# EAGLE schematic NetworkArduino (EAGLE 7.4.0)
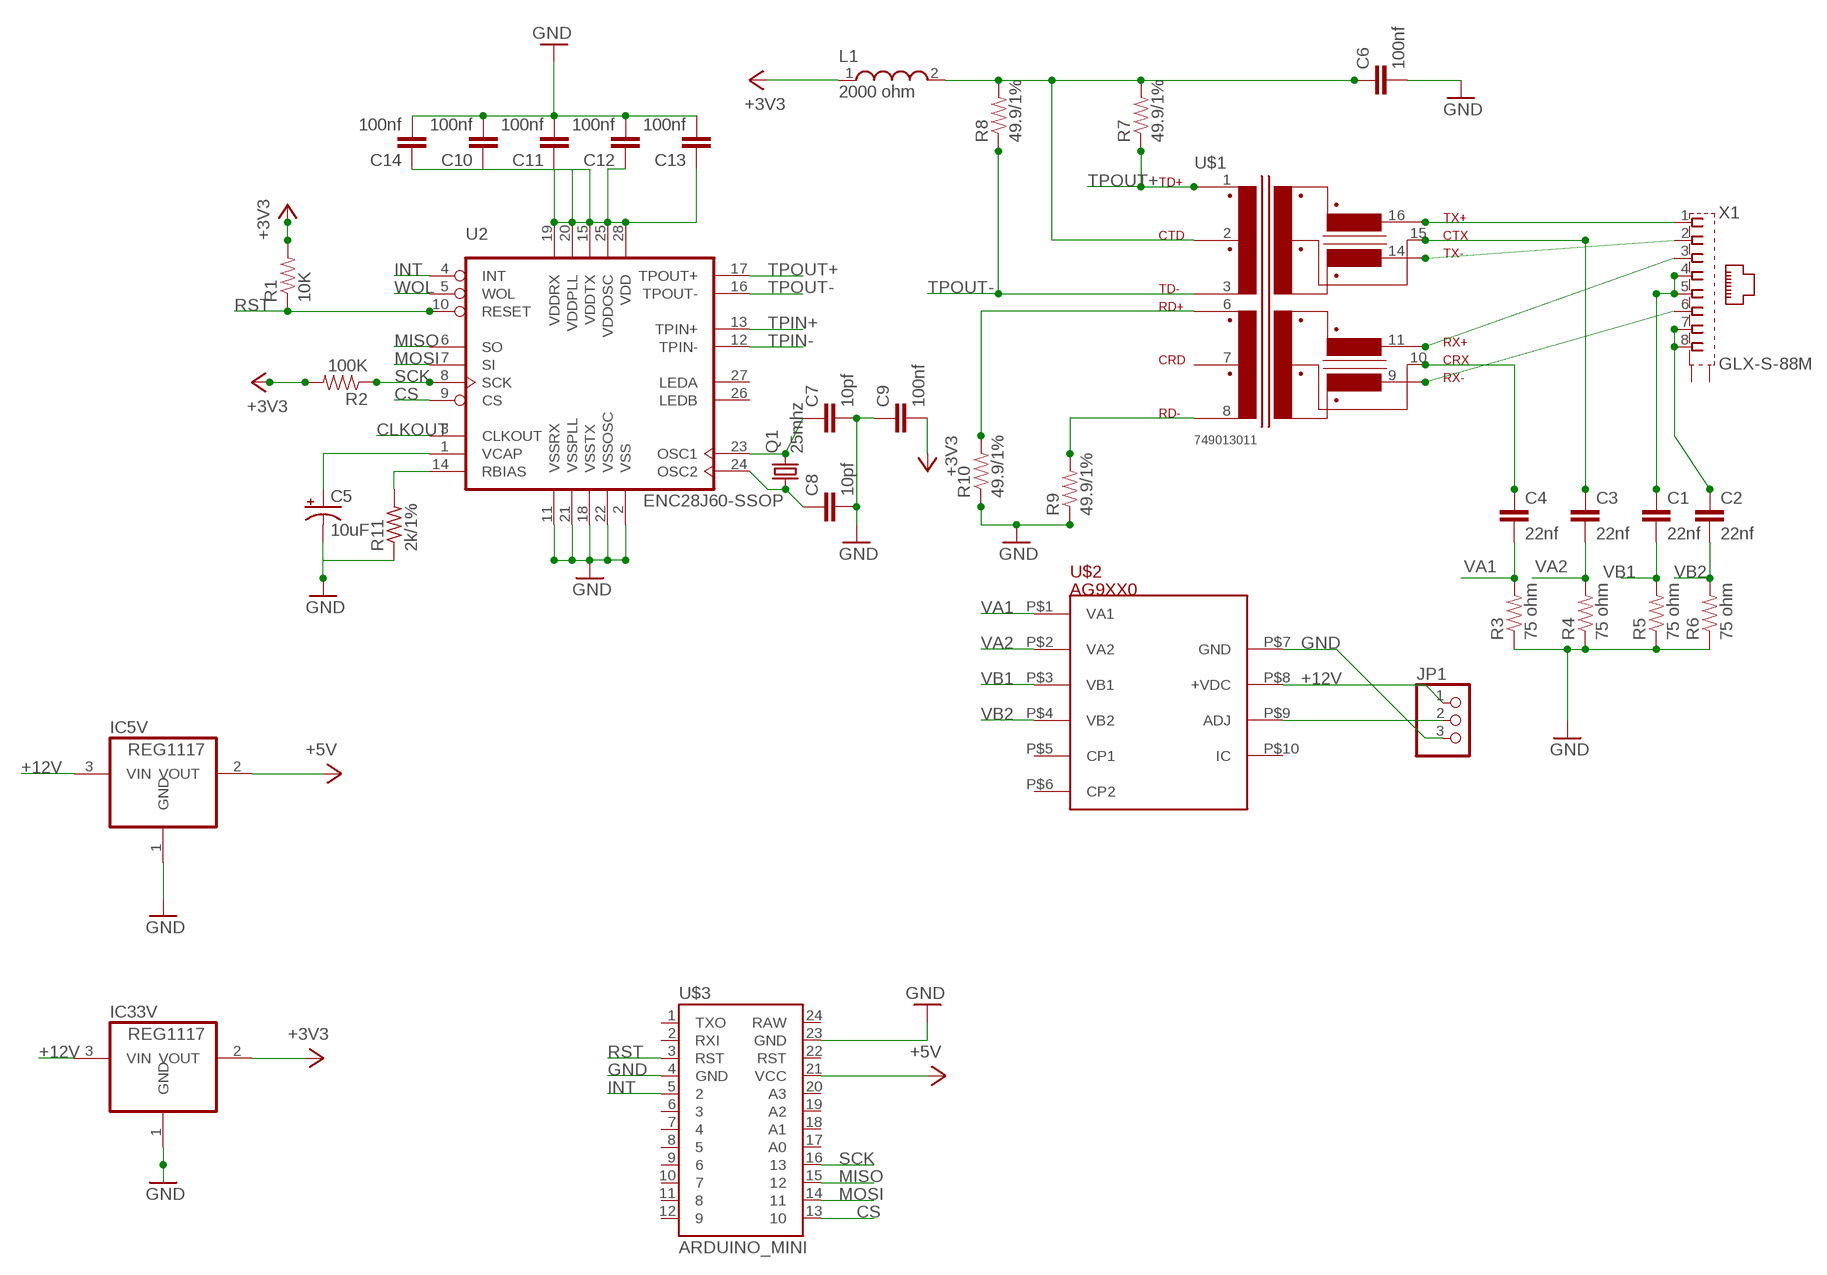
[diagram p0: schematic, sheet 1]

## Parts
C1  22nf  CAP0805  [0805]
C2  22nf  CAP0805  [0805]
C3  22nf  CAP0805  [0805]
C4  22nf  CAP0805  [0805]
C5  10uF  10UF-16V-10%(TANT)  [EIA3216]
C6  100nf  CAP0805  [0805]
C7  10pf  CAP0805  [0805]
C8  10pf  CAP0805  [0805]
C9  100nf  CAP0805  [0805]
C10  100nf  CAP0805  [0805]
C11  100nf  CAP0805  [0805]
C12  100nf  CAP0805  [0805]
C13  100nf  CAP0805  [0805]
C14  100nf  CAP0805  [0805]
IC5V  REG1117  [SOT223]
IC33V  REG1117  [SOT223]
JP1  PINHD-1X3  [1X03]
L1  2000 ohm  WE-CBA_0805(WB/HS)  [WE-CBA_0805(W=3)]
Q1  25mhz  CRYSTALHC49UP  [HC49UP]
R1  10K  RESISTOR0805-RES  [0805]
R2  100K  RESISTOR0805-RES  [0805]
R3  75 ohm  RESISTOR0805-RES  [0805]
R4  75 ohm  RESISTOR0805-RES  [0805]
R5  75 ohm  RESISTOR0805-RES  [0805]
R6  75 ohm  RESISTOR0805-RES  [0805]
R7  49.9/1%  RESISTOR0805-RES  [0805]
R8  49.9/1%  RESISTOR0805-RES  [0805]
R9  49.9/1%  RESISTOR0805-RES  [0805]
R10  49.9/1%  RESISTOR0805-RES  [0805]
R11  2k/1%  R-US_R0805  [R0805]
U2  ENC28J60-SSOP  [SSOP28]
U$1  749013011  [749013011]
U$2  AG9XX0  [AG9000]
U$3  ARDUINO_MINI  [ARDUINO_MINI]
X1  GLX-S-88M  [GLX-S-88M]

## Nets
+3V3: C9.2 IC33V.2(VOUT) L1.1 R1.2 R2.2
+5V: IC5V.2(VOUT) U$3.21(VCC)
+12V: IC5V.3(VIN) IC33V.3(VIN) JP1.1 U$2.P$8(+VDC)
CLKOUT: U2.3(CLKOUT)
CS: U2.9(CS) U$3.13
GND: C5.C(-) C6.2 C7.2 C8.2 C9.1 C10.2 C11.2 C12.2 C13.2 C14.2 IC5V.1(GND) IC33V.1(GND) JP1.3 R3.1 R4.1 R5.1 R6.1 R9.1 R10.1 R11.1 U2.2(VSS) U2.11(VSSRX) U2.18(VSSTX) U2.21(VSSPLL) U2.22(VSSOSC) U$2.P$7(GND) U$3.4(GND) U$3.23(GND)
INT: U2.4(INT) U$3.5
MISO: U2.6(SO) U$3.15
MOSI: U2.7(SI) U$3.14
N$1: U$1.16 X1.1
N$2: U$1.14 X1.2
N$3: U$1.11 X1.3
N$4: U$1.9 X1.6
N$5: C2.1 X1.7 X1.8
N$6: C1.1 X1.4 X1.5
N$7: C3.1 U$1.15
N$8: C4.1 U$1.10
N$9: C6.1 L1.2 R7.2 R8.2 U$1.2
N$10: C7.1 Q1.2 U2.23(OSC1)
N$11: JP1.2 U$2.P$9(ADJ)
N$13: C8.1 Q1.1 U2.24(OSC2)
N$14: C10.1 C11.1 C12.1 C13.1 C14.1 U2.15(VDDTX) U2.19(VDDRX) U2.20(VDDPLL) U2.25(VDDOSC) U2.28(VDD)
N$16: C5.A(+) U2.1(VCAP)
N$17: R11.2 U2.14(RBIAS)
RST: R1.1 U2.10(RESET) U$3.3(RST)
SCK: R2.1 U2.8(SCK) U$3.16
TPIN+: R10.2 U2.13(TPIN+) U$1.6
TPIN-: R9.2 U2.12(TPIN-) U$1.8
TPOUT+: R7.1 U2.17(TPOUT+) U$1.1
TPOUT-: R8.1 U2.16(TPOUT-) U$1.3
VA1: C4.2 R3.2 U$2.P$1(VA1)
VA2: C3.2 R4.2 U$2.P$2(VA2)
VB1: C1.2 R5.2 U$2.P$3(VB1)
VB2: C2.2 R6.2 U$2.P$4(VB2)
WOL: U2.5(WOL)
Unconnected: U2.26(LEDB) U2.27(LEDA) U$1.7 U$2.P$5(CP1) U$2.P$6(CP2) U$2.P$10(IC) U$3.1(TXO) U$3.2(RXI) U$3.6 U$3.7 U$3.8 U$3.9 U$3.10 U$3.11 U$3.12 U$3.17(A0) U$3.18(A1) U$3.19(A2) U$3.20(A3) U$3.22(RST) U$3.24(RAW) X1.S1 X1.S2

## Library data of the parts
C1-C4 C6-C14 = SparkFun-Capacitors:CAP: Capacitor Standard 0603 ceramic capacitor, and 0.1" leaded capacitor.
C5 = SparkFun-Capacitors:10UF-16V-10%(TANT): CAP-00811 1206/EIA-3216 Tantalum capacitor; PROD_ID: CAP-00811
IC5V IC33V = burr-brown:REG1117: 800mA and 1A Low Dropout (LDO) Positive Regulator 1.8V, 2.5V, 2.85V, 3.3V, 5V, and Adj; MPN: REG1117; OC_FARNELL: 1097566; OC_NEWARK: 14P6981
JP1 = Adafruit:PINHD-1X3: PIN HEADER
L1 = SignalCommunications:WE-CBA: WE-CBA SMD EMI Suppression Ferrite Bead Characteristics Reliable Ni-Sn electrodes High rated current up to 5A Recommended soldering: Reflow Operating temperature: -55°C to +125°C Applications * Perfect as data line filter and for uncoupling of distribution voltage *This special SMD chip bead ferrites can be put directly on the printed circuit board. They offer excellent anti-EMI properties and low DC-resistance. Placed very close next to the interference source even with smallest size 0402,maximal impedance at 1000 Ω can be reached. *High Speed: "High Speed " SMD ferrites WE-CBF have lower impedance in the lower frequency ranges thus they have only a low attenuation for fast signals. Application e.g. USB 2.0, IEEE 1394,LVDS *Wide Band: "Wide Band" SMD ferrites WE-CBF already show high impedance in low frequency range. Therefore they are wide band through the whole spectrum. Application e.g. control signats, RS232, RS422, DC/DC converter *High Current: "High Current " SMD ferrites WE-CBF are designed for high current (over 1 A). The rated current refers to 40K self-heating. High current SMD ferrites are available in all there types (High Speed, Wide Band and High Frequency). Application e.g. power supply, DC/DC converter *Advice: Pay attention for the use of SMD-Ferrites for high current>1A and ambient temperature over +85°C that the rated current has to be reduced when temperature is above +85°C (Derating). *At+100°C environment temperature the maximal rated current has to add up to only 60% of the data sheet value ,without an overload of the component. Variant abbreviation WB means WIDE BAND HS means HIGH SPEED HC means HIGH CURRENT <http://katalog.we-online.de/media/images/eisos/FeCBA_pf2.jpg> Details see: http://katalog.we-online.de/en/pbs/WE-CBA/ Created: 2015-02-02 2015 (C) Wurth Elektronik
Q1 = Adafruit:CRYSTAL: CRYSTAL; OC_FARNELL: unknown; OC_NEWARK: unknown
R1-R10 = SparkFun-Resistors:RESISTOR: Resistor Basic schematic elements and footprints for 0603, 1206, and PTH resistors.
R11 = Adafruit:R-US_: RESISTOR, American symbol
U2 = microchip-enc28j60:ENC28J60-*: Microchip 10Mbit Eth. contoller with SPI interface
U$1 = Wurth_Electronics_Midcom_Speedy_and_standard_magnetics:749013011: Package Style: 10/100, 1 Port, ETR, PoE Mounting: SMD Pins: 16 pins Header: 250-0512 Best pinouts for production vary per application. Please contact Wurth Electronics Midcom, Inc. for assistance with your custom design. Datasheet: 749013011 <http://katalog.we-online.de/kataloge/eisos/media/pdf/749013011.pdf> Website: Wurth Electronics Midcom <http://www.we-online.com/midcom> Contact us Wurth Electronics Midcom, Inc. 121 Airport Dr. Watertown, SD 57201 Phone: (605) 886-4385 Fax: (605) 886-4486 E-Mail: midcom@we-online.com
U$2 = SmartPrj:AG9XX0: PoE module
U$3 = SparkFun-Boards:ARDUINO_MINI: Arduino Pro Mini footprint
X1 = con-kycon:GLX-S-88M: Mod. Jack, Right Angle, 8 posiotion, 8 contatcs RJ45 Source: GLX-S-88M.pdf; OC_FARNELL: unknown; OC_NEWARK: unknown